# EAGLE design circuit (EAGLE 6.6.0)
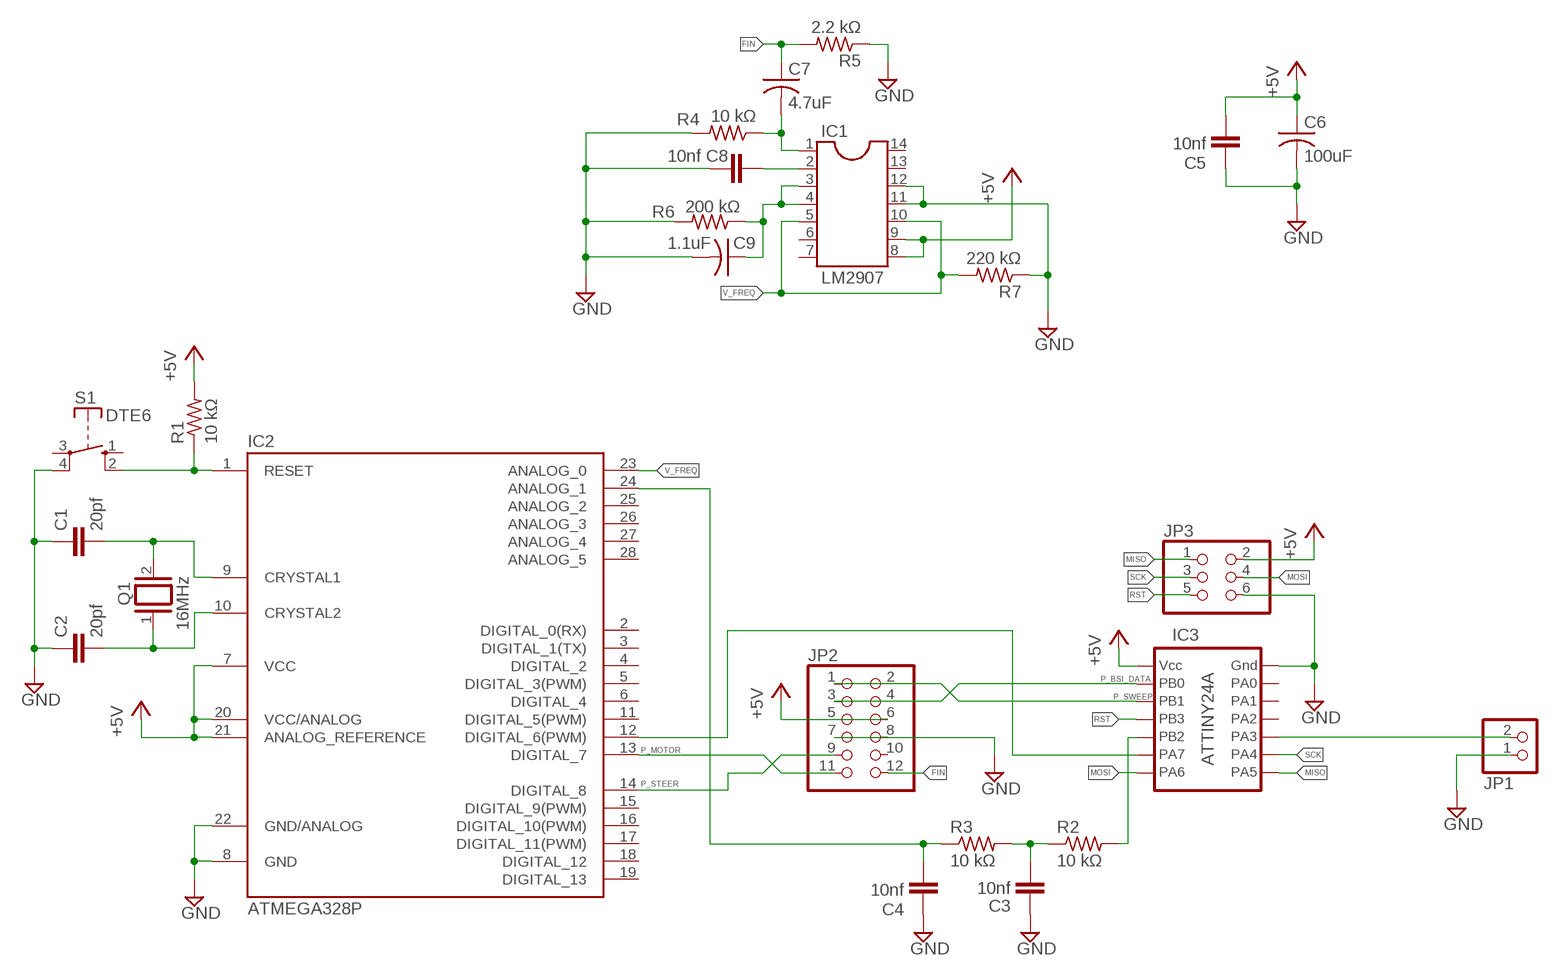
[diagram p0: schematic, sheet 1]

## Parts
C1  20pf  C-EU025-024X044  [C025-024X044]
C2  20pf  C-EU025-024X044  [C025-024X044]
C3  10nf  C-EU025-024X044  [C025-024X044]
C4  10nf  C-EU025-024X044  [C025-024X044]
C5  10nf  C-EU025-024X044  [C025-024X044]
C6  100uF  C-US025-050X050  [C025-050X050]
C7  4.7uF  C-US025-050X050  [C025-050X050]
C8  10nf  C-EU025-024X044  [C025-024X044]
C9  1.1uF  C-US025-050X050  [C025-050X050]
IC1  LM2907  DIL14  [DIL14]
IC2  ATMEGA328P  ATMEGA168-PU  [DIL28-3]
IC3  ATTINY24A  [TINY24A]
JP1  PINHD-1X2  [1X02]
JP2  PINHD-2X6  [2X06]
JP3  PINHD-2X3  [2X03]
Q1  16MHz  XTAL/S  [QS]
R1  10 kΩ  R-US_0204/2V  [0204V]
R2  10 kΩ  R-US_0204/2V  [0204V]
R3  10 kΩ  R-US_0204/2V  [0204V]
R4  10 kΩ  R-US_0204/2V  [0204V]
R5  2.2 kΩ  R-US_0204/2V  [0204V]
R6  200 kΩ  R-US_0204/2V  [0204V]
R7  220 kΩ  R-US_0204/2V  [0204V]
S1  DTE6  [DTE6]

## Nets
+5V: C5.2 C6.1 IC1.8 IC1.9 IC2.7(VCC) IC2.20(VCC/ANALOG) IC2.21(ANALOG_REFERENCE) IC3.1 JP2.5 JP2.6 JP3.2 R1.2
DATA-READY: IC2.12(DIGITAL_6(PWM)) IC3.6
FIN: C7.1 JP2.12 R5.2
GND: C1.1 C2.1 C3.1 C4.1 C5.1 C6.2 C8.1 C9.2 IC1.11 IC1.12 IC2.8(GND) IC2.22(GND/ANALOG) IC3.14 JP1.1 JP2.7 JP2.8 JP3.6 R4.2 R5.1 R6.2 R7.1 S1.4(P)
LINE-POSITION: C4.2 IC2.24(ANALOG_1) R3.1
MISO: IC3.8 JP3.1
MOSI: IC3.7 JP3.4
N$1: C9.1 IC1.3 IC1.4 R6.1
N$3: IC3.10 JP1.2
N$4: IC3.5 R2.2
N$5: C1.2 IC2.9(CRYSTAL1) Q1.2
N$6: C2.2 IC2.10(CRYSTAL2) Q1.1
N$7: C3.2 R2.1 R3.2
N$8: IC2.1(RESET) R1.1 S1.2(S)
N$9: C7.2 IC1.1 R4.1
N$12: C8.2 IC1.2
P_BSI_DATA: IC3.2 JP2.3 JP2.4
P_MOTOR: IC2.13(DIGITAL_7) JP2.11
P_STEER: IC2.14(DIGITAL_8) JP2.9
P_SWEEP: IC3.3 JP2.1 JP2.2
RST: IC3.4 JP3.5
SCK: IC3.9 JP3.3
V_FREQ: IC1.5 IC1.10 IC2.23(ANALOG_0) R7.2
Unconnected: IC1.6 IC1.7 IC1.13 IC1.14 IC2.2(DIGITAL_0(RX)) IC2.3(DIGITAL_1(TX)) IC2.4(DIGITAL_2) IC2.5(DIGITAL_3(PWM)) IC2.6(DIGITAL_4) IC2.11(DIGITAL_5(PWM)) IC2.15(DIGITAL_9(PWM)) IC2.16(DIGITAL_10(PWM)) IC2.17(DIGITAL_11(PWM)) IC2.18(DIGITAL_12) IC2.19(DIGITAL_13) IC2.25(ANALOG_2) IC2.26(ANALOG_3) IC2.27(ANALOG_4) IC2.28(ANALOG_5) IC3.11 IC3.12 IC3.13 JP2.10 S1.1(S) S1.3(P)

## Library data of the parts
C1-C5 C8 = rcl:C-EU: CAPACITOR, European symbol
C6 C7 C9 = rcl:C-US: CAPACITOR, American symbol
IC1 = ic-package:DIL14: Dual In Line / Socket
IC2 = Arduino-AVR:ATMEGA168-PU
IC3 = ATtiny24A:ATTINY24A
JP1 = pinhead:PINHD-1X2: PIN HEADER
JP2 = pinhead:PINHD-2X6: PIN HEADER
JP3 = pinhead:PINHD-2X3: PIN HEADER
Q1 = special:XTAL/S: CRYSTAL
R1-R7 = resistor:R-US_: RESISTOR, American symbol
S1 = switch-misc:DT: ITT SWITCH

## Board
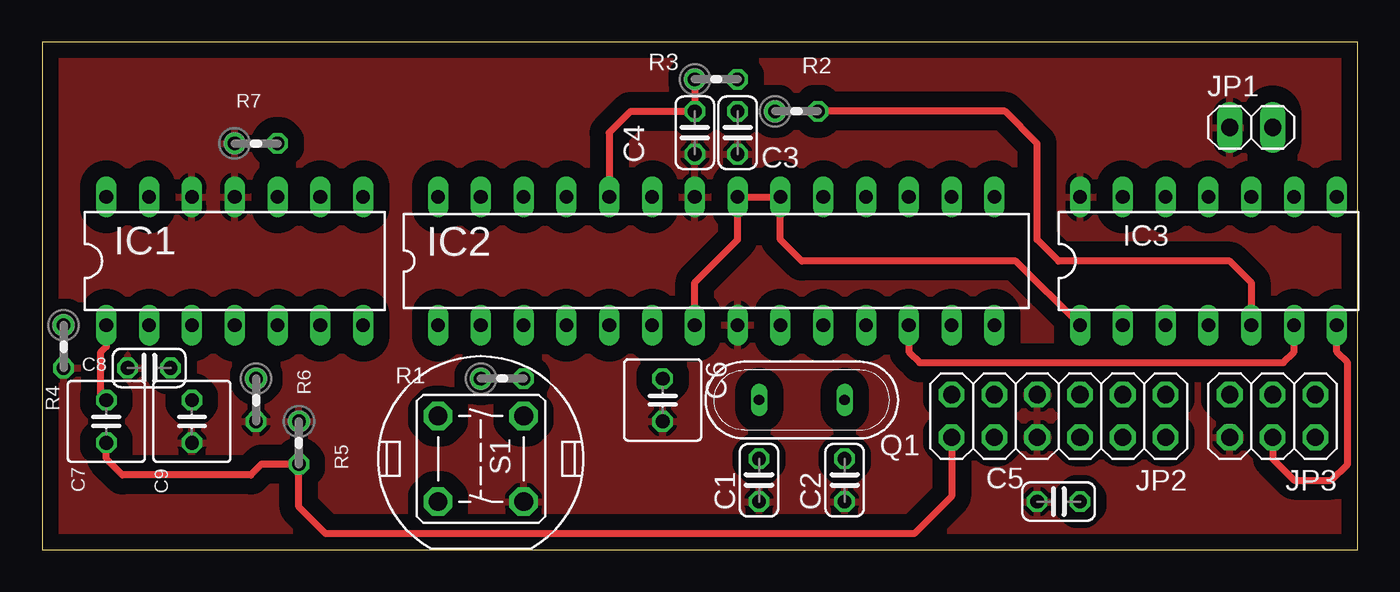
[diagram p1: board, top side]
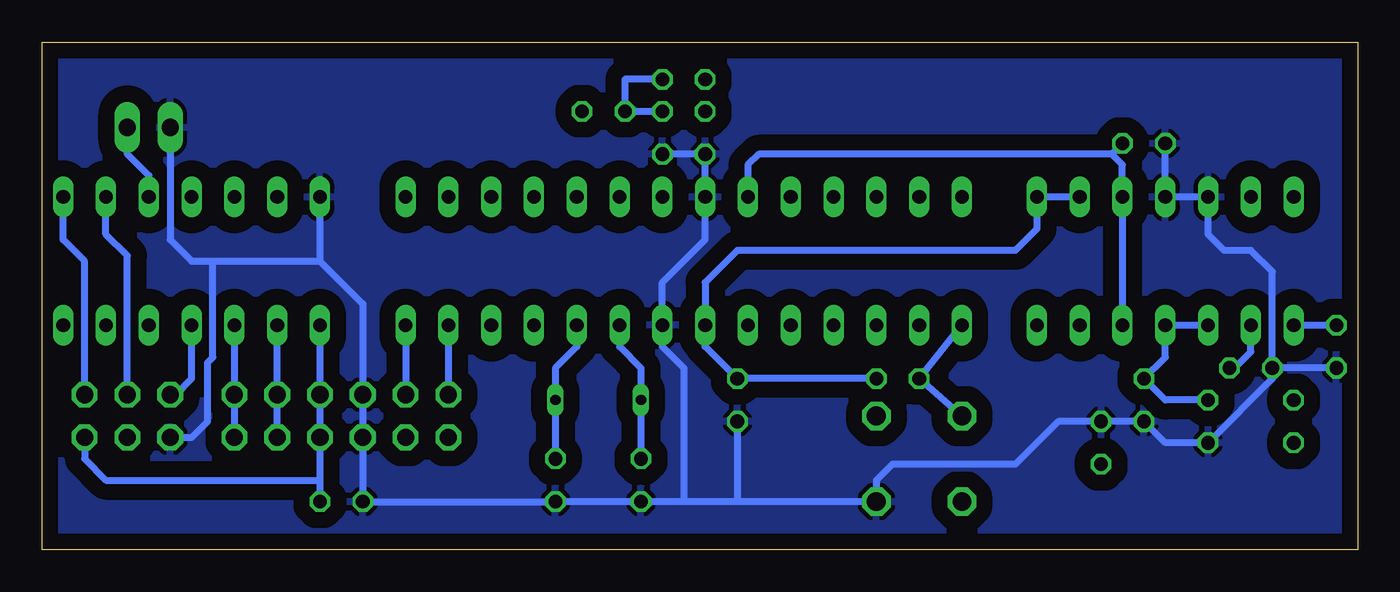
[diagram p2: board, bottom side, seen from below]

Size 78.08 x 30.15 mm. Coordinates in mm from the lower left corner, seen from the top.
Outline: 0,0 78.08,0 78.08,30.15 0,30.15 0,0
Copper layers (1*16): Top 0.0356mm / dielectric 1.5011mm / Bottom 0.0356mm
Design rules "OSHpark - LaenPCBOrder": minimum track width 6mil, minimum drill 13mil, track to track 6mil, track to pad 6mil, pad to pad 6mil, via to via 6mil, smd to smd 6mil, copper to edge 15mil, drill to drill 6mil, minimum pad ring 7mil, minimum via ring 7mil, stop-mask expansion 3mil, vias tented up to drill 0mil, thermal gap 10mil

### Footprints (pad centres in the part's own frame; a part is rotated, then mirrored left to right if it is on the bottom)
C025-024X044 = drill 0.813 octagon: 1 -1.27,0; 2 1.27,0
C025-050X050 = drill 0.813 octagon: 1 -1.27,0; 2 1.27,0
DIL14 = drill 0.813 long: 1 -7.62,-3.81; 2 -5.08,-3.81; 3 -2.54,-3.81; 4 0,-3.81; 5 2.54,-3.81; 6 5.08,-3.81; 7 7.62,-3.81; 8 7.62,3.81; 9 5.08,3.81; 10 2.54,3.81; 11 0,3.81; 12 -2.54,3.81; 13 -5.08,3.81; 14 -7.62,3.81
DIL28-3 = drill 0.813 long: 1 -16.51,-3.81; 2 -13.97,-3.81; 3 -11.43,-3.81; 4 -8.89,-3.81; 5 -6.35,-3.81; 6 -3.81,-3.81; 7 -1.27,-3.81; 8 1.27,-3.81; 9 3.81,-3.81; 10 6.35,-3.81; 11 8.89,-3.81; 12 11.43,-3.81; 13 13.97,-3.81; 14 16.51,-3.81; 15 16.51,3.81; 16 13.97,3.81; 17 11.43,3.81; 18 8.89,3.81; 19 6.35,3.81; 20 3.81,3.81; 21 1.27,3.81; 22 -1.27,3.81; 23 -3.81,3.81; 24 -6.35,3.81; 25 -8.89,3.81; 26 -11.43,3.81; 27 -13.97,3.81; 28 -16.51,3.81
TINY24A = drill 0.813 long: 1 -1.27,-5.08; 2 1.27,-5.08; 3 3.81,-5.08; 4 6.35,-5.08; 5 8.89,-5.08; 6 11.43,-5.08; 7 13.97,-5.08; 8 13.97,2.54; 9 11.43,2.54; 10 8.89,2.54; 11 6.35,2.54; 12 3.81,2.54; 13 1.27,2.54; 14 -1.27,2.54
1X02 = drill 1.016 long: 1 -1.27,0; 2 1.27,0
2X06 = drill 1.016 octagon: 1 -6.35,-1.27; 2 -6.35,1.27; 3 -3.81,-1.27; 4 -3.81,1.27; 5 -1.27,-1.27; 6 -1.27,1.27; 7 1.27,-1.27; 8 1.27,1.27; 9 3.81,-1.27; 10 3.81,1.27; 11 6.35,-1.27; 12 6.35,1.27
2X03 = drill 1.016 octagon: 1 -2.54,-1.27; 2 -2.54,1.27; 3 0,-1.27; 4 0,1.27; 5 2.54,-1.27; 6 2.54,1.27
QS = drill 0.61 long: 1 -2.54,0; 2 2.54,0
0204V = drill 0.813 octagon: 1 -1.27,0; 2 1.27,0
DTE6 = drill 1.118 octagon: 1 -2.54,2.54; 2 2.54,2.54; 3 2.54,-2.54; 4 -2.54,-2.54

### Placement (x,y rotation side)
C1  42.55,4.13 90 top
C2  47.62,4.13 90 top
C3  41.27,24.77 90 top
C4  38.73,24.77 90 top
C5  60.33,2.86 0 top
C6  36.83,8.89 270 top
C7  3.81,7.62 90 top
C8  6.35,10.79 0 top
C9  8.89,7.62 270 top
IC1  11.43,17.14 0 top
IC2  40.01,17.14 0 top
IC3  62.87,18.41 0 top
JP1  71.75,25.08 0 top
JP2  60.33,7.94 180 top
JP3  73.03,7.94 180 top
Q1  45.09,8.89 180 top
R1  27.3,10.16 0 top
R2  44.77,26.04 0 top
R3  40.01,27.94 0 top
R4  1.27,12.06 270 top
R5  15.24,6.35 270 top
R6  12.7,8.89 270 top
R7  12.7,24.13 0 top
S1  26.04,5.4 90 top

### Tracks (layer width: path | path; a pad name or v marks a point on that pad's centre or on a via)
+5V
  Top 0.406: IC2.7 38.73,15.88 41.27,18.41 IC2.21 IC2.20 43.81,18.41 45.09,17.14 57.78,17.14 IC3.1
  Bottom 0.406: R1.2 C6.1 38.73,12.06 IC2.7 38.73,15.88 36.83,17.78 20.32,17.78 19.05,19.05 IC1.8 IC1.9 | 61.59,4.13 JP2.6 JP2.5 IC3.1 | 61.59,4.13 C5.2 | JP3.2 75.56,5.4 74.3,4.13 61.59,4.13
DATA-READY
  Top 0.406: IC2.12 51.44,11.75 52.07,11.11 73.66,11.11 74.3,11.75 IC3.6
FIN
  Top 0.406: JP2.12 53.98,3.17 51.75,0.95 16.83,0.95 15.24,2.54 R5.2 13.02,5.08 12.38,4.45 4.76,4.45 3.81,5.4 C7.1
GND
  Bottom 0.406: 40.01,2.86 40.01,10.79 41.27,12.06 IC2.8 41.27,15.88 38.73,18.41 IC2.22 C4.1 C3.1 | 40.01,2.86 C1.1 C2.1 C5.1 JP2.8 JP2.7 59.05,14.61 61.59,17.14 | 36.83,2.86 S1.4 28.57,4.13 27.62,5.08 20.32,5.08 17.78,7.62 R5.1 R6.2 11.43,6.35 C9.2 5.08,10.16 C8.1 | 36.83,2.86 40.01,2.86 | IC3.14 61.59,17.14 | JP1.1 70.48,18.41 69.22,17.14 67.94,17.14 | 67.94,17.14 61.59,17.14 | C6.2 36.83,2.86 | JP3.6 69.22,6.67 68.26,7.62 68.26,11.11 67.94,11.43 67.94,17.14 | R4.2 C8.1 | C8.1 5.08,16.51 6.35,17.78 7.94,17.78 8.89,18.73 IC1.12 IC1.11 R7.1
  pour Bottom (isolate 0.953): 0.32,29.84 0.32,0.32 77.79,0.32 77.79,29.84
  pour Top (isolate 0.953): 0.32,29.84 0.32,0.32 77.79,0.32 77.79,29.84
LINE-POSITION
  Top 0.406: R3.1 C4.2 34.92,26.04 33.66,24.77 IC2.24
MISO
  Bottom 0.406: JP3.1 75.56,17.14 76.83,18.41 IC3.8
MOSI
  Top 0.406: JP3.4 73.03,5.4 74.3,4.13 76.52,4.13 77.47,5.08 77.47,11.11 76.83,11.75 IC3.7
N$1
  Bottom 0.406: C9.1 11.43,8.89 R6.1 11.43,11.43 IC1.4 IC1.3
N$3
  Bottom 0.406: IC3.10 71.75,22.23 73.03,23.5 JP1.2
N$4
  Top 0.406: R2.2 57.15,26.04 59.05,24.13 59.05,18.41 60.33,17.14 70.48,17.14 71.75,15.88 IC3.5
N$5
  Bottom 0.406: IC2.9 43.81,12.06 42.55,10.79 Q1.2 C1.2
N$6
  Bottom 0.406: IC2.10 46.35,12.06 47.62,10.79 Q1.1 C2.2
N$7
  Bottom 0.406: R3.2 43.5,27.94 R2.1 C3.2
N$8
  Bottom 0.406: IC2.1 R1.1 S1.2
N$9
  Top 0.406: C7.2 3.49,9.21 3.49,11.75 3.81,12.06 IC1.1
  Bottom 0.406: IC1.1 R4.1
N$12
  Bottom 0.406: C8.2 7.3,10.79 6.35,11.75 IC1.2
P_BSI_DATA
  Bottom 0.406: JP2.4 JP2.3 IC3.2
P_MOTOR
  Bottom 0.406: IC2.13 JP2.11
P_STEER
  Bottom 0.406: IC2.14 JP2.9
P_SWEEP
  Bottom 0.406: IC3.3 JP2.1 JP2.2
RST
  Bottom 0.406: JP3.5 70.17,9.21 69.22,10.16 IC3.4
SCK
  Bottom 0.406: JP3.3 73.03,17.46 74.3,18.73 IC3.9
V_FREQ
  Bottom 0.406: 14.61,23.5 13.97,22.86 IC1.10 IC1.5 | 14.61,23.5 35.56,23.5 36.2,22.86 IC2.23 | R7.2 14.61,23.5